# EasyEDA Pro project GD32F470IIH6.epro, board PCB1
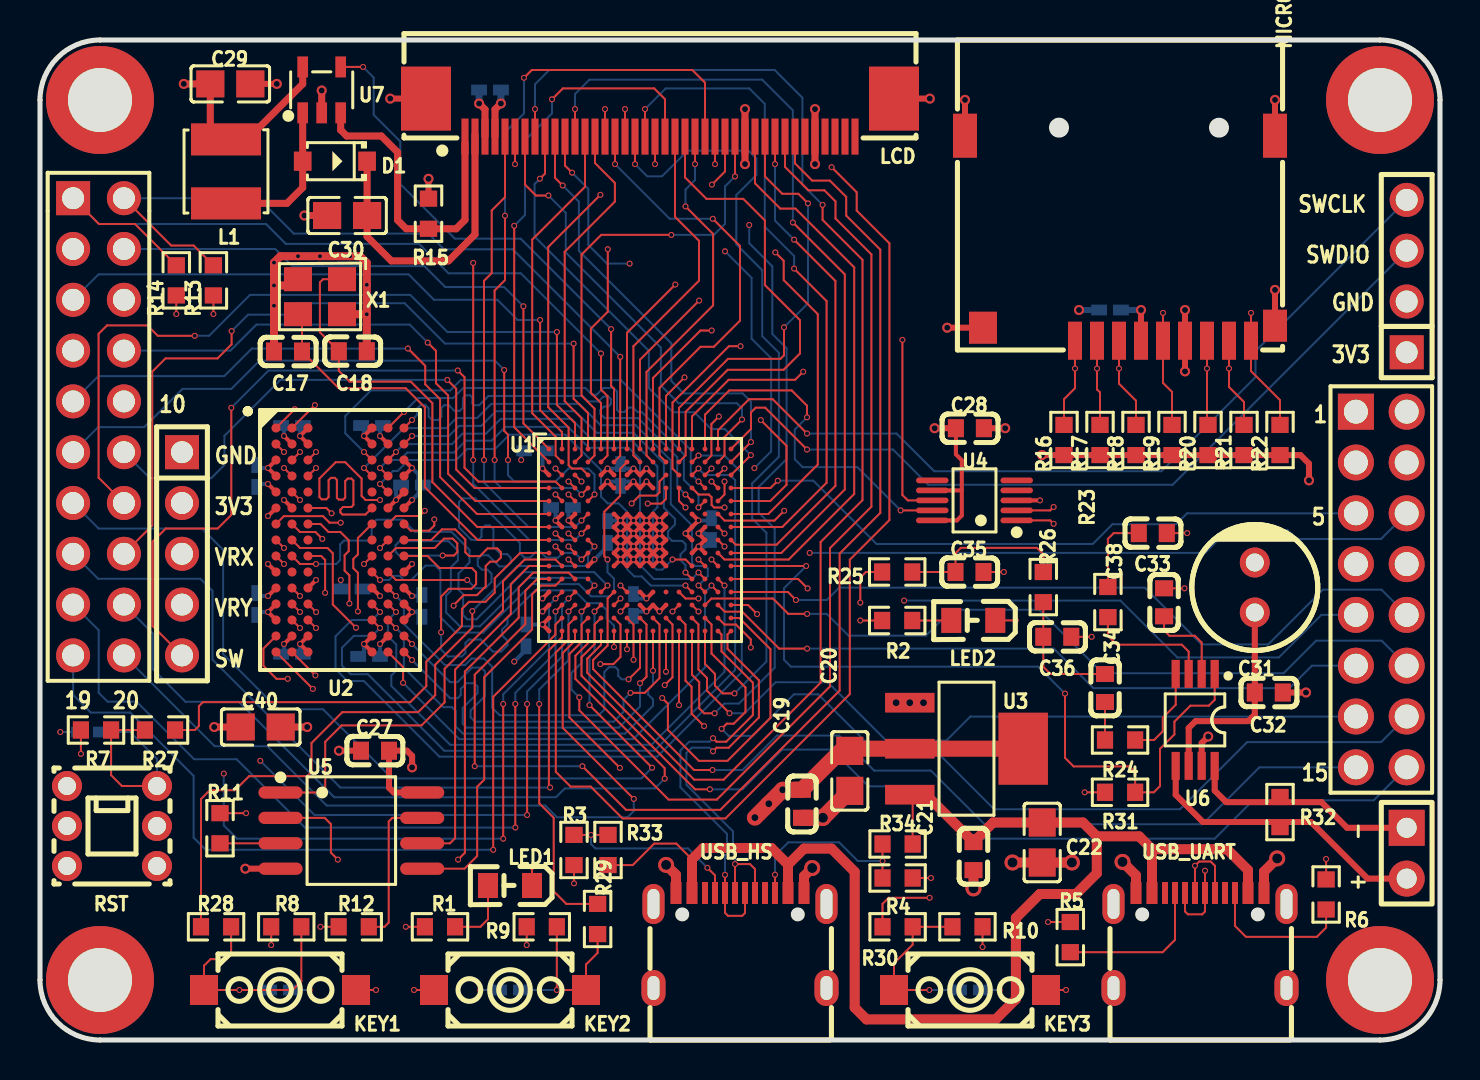
[diagram p1: board, top side]
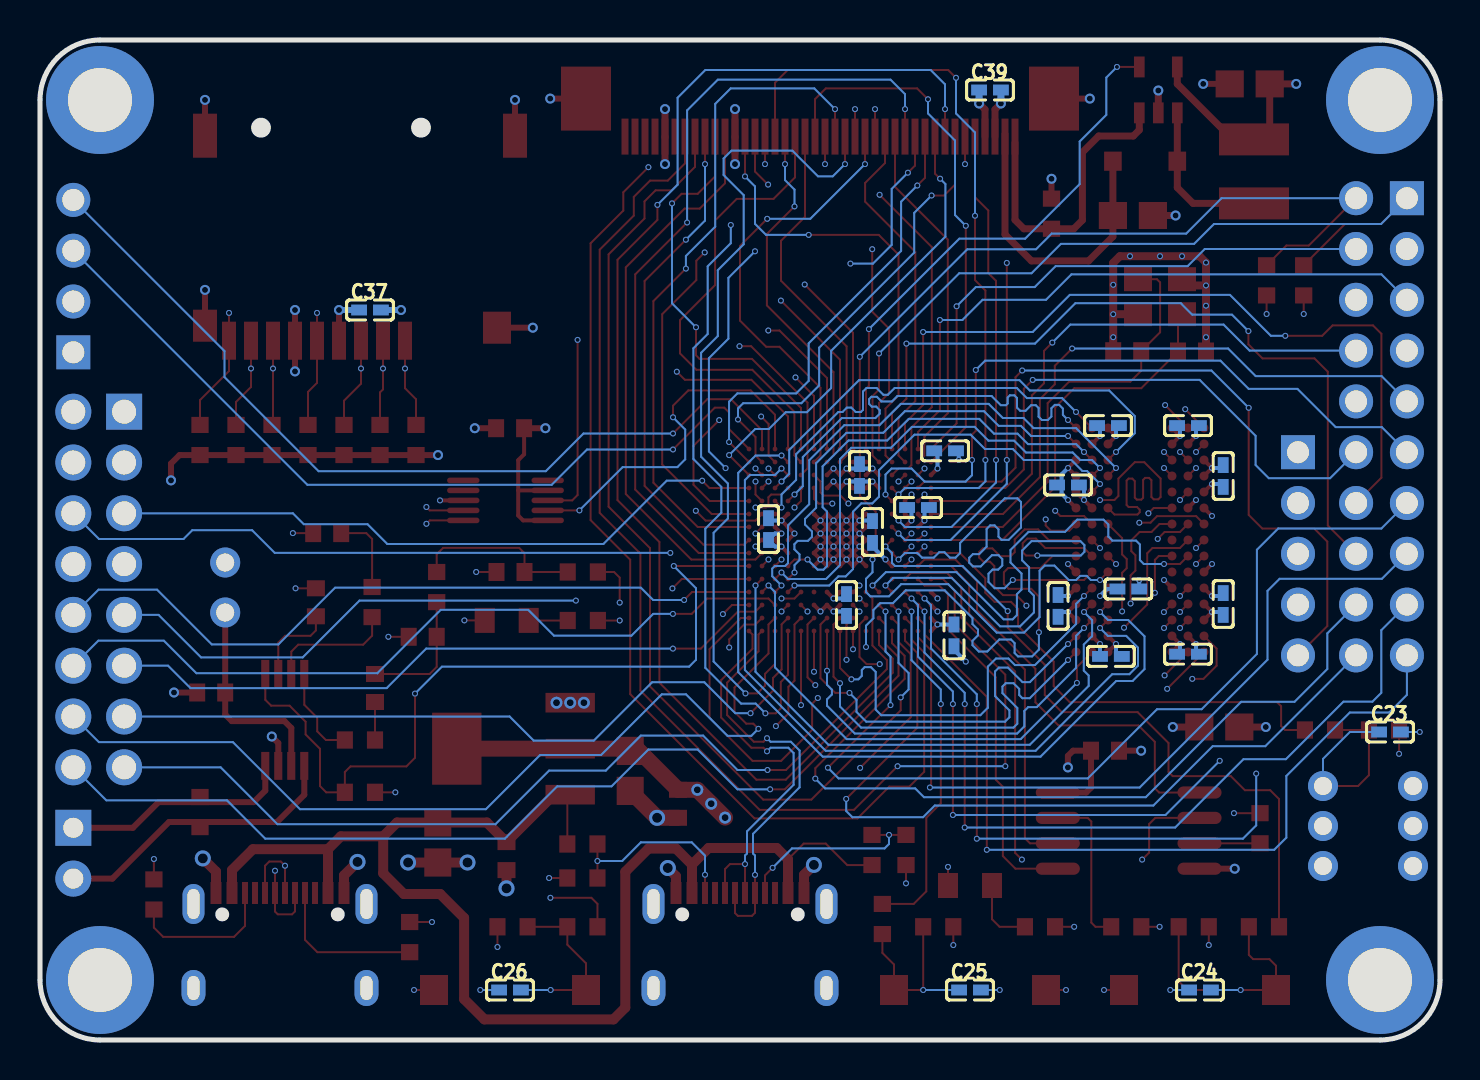
[diagram p2: board, bottom side, seen from below]

Outline 70 x 50 mm; copper layers: Top Layer, GND1, PWR, SIG, GND2, Bottom Layer. Coordinates in mm from the lower left corner of the outline.
Outline path: 0,47 0,3 arc(0.88,0.88) 3,0 67,0 arc(69.12,0.88) 70,3 70,47 arc(69.12,49.12) 67,50 3,50 arc(0.88,49.12) 0,47
Stack: Top Layer 0.035mm 外层铜厚1oz / Dielectric1 0.0994mm 3313 RC57% 4.2mil / GND1 0.0152mm 内层铜厚 / Dielectric2 0.55mm 0.55mm H/H不含铜 / PWR 0.0152mm 内层铜厚 / Dielectric3 0.1088mm 2116 RC54% 4.9mil / SIG 0.0152mm 内层铜厚 / Dielectric4 0.55mm 0.55mm H/H不含铜 / GND2 0.0152mm 内层铜厚 / Dielectric5 0.0994mm 3313 RC57% 4.2mil / Bottom Layer 0.035mm 外层铜厚1oz

## Design rules (mm)
net F_CS: SPI_FLASH
net D+: DP2
net D-: DP2
net LCD_R0: LCD
net LCD_R1: LCD
net F_MISO: SPI_FLASH
net F_MOSI: SPI_FLASH
net F_SCLK: SPI_FLASH
net LCD_DE: LCD
net LCD_VS: LCD
net LCD_HS: LCD
net LCD_EN: LCD
net LCD_CLK: LCD
net LCD_B7: LCD
net LCD_B6: LCD
net LCD_B5: LCD
net LCD_B4: LCD
net LCD_B3: LCD
net LCD_B2: LCD
net LCD_B1: LCD
net LCD_B0: LCD
net LCD_G7: LCD
net LCD_G6: LCD
net LCD_G5: LCD
net LCD_G4: LCD
net LCD_G3: LCD
net LCD_G2: LCD
net LCD_G1: LCD
net LCD_G0: LCD
net LCD_R7: LCD
net LCD_R6: LCD
net LCD_R5: LCD
net LCD_R4: LCD
net LCD_R3: LCD
net LCD_R2: LCD
net USB_DP: DP1
net USB_DN: DP1
template: 用户自定义配置
spacing safeClearance (default): track to track 0.11, other pairs 0.11 to 0.3
track width trackWidth (default): min 0.099, default 0.254, max 2.54
differential pair differentialPair (default): width min 0.1, default 0.1, max 2.54; gap min 0.1, default 0.2
via viaSize (default): diameter min 0.3, default 0.61, max 10; hole min 0.099, default 0.305, max 5.999

## Placement (name value [footprint] x y rotation side)
C1  100nF  [C0402]  24.75 29.46 0 bottom
C2  100nF  [C0402]  29.03 28.25 90 bottom
C3  100nF  [C0402]  26.1 26.62 0 bottom
C4  100nF  [C0402]  33.57 25.55 270 bottom
C5  100nF  [C0402]  28.38 25.4 270 bottom
C6  100nF  [C0402]  29.68 21.75 270 bottom
C7  100nF  [C0402]  24.3 20.23 90 bottom
C8  100nF  [C0402]  12.6 30.72 180 bottom
C9  100nF  [C0402]  16.6 30.72 180 bottom
C10  100nF  [C0402]  18.6 27.75 0 bottom
C11  100nF  [C0402]  10.84 28.2 270 bottom
C12  100nF  [C0402]  10.84 21.8 90 bottom
C13  100nF  [C0402]  15.58 22.55 0 bottom
C14  100nF  [C0402]  19.09 21.7 270 bottom
C15  100nF  [C0402]  12.6 19.29 180 bottom
C16  100nF  [C0402]  16.45 19.18 180 bottom
C17  12pF  [C0603]  12.4 34.42 180 top
C18  12pF  [C0603]  15.64 34.44 0 top
C19  100nF  [C0603]  38.1 11.81 90 top
C20  10uF  [C0805]  40.49 13.45 90 top
C21  100nF  [C0603]  46.68 9.19 90 top
C22  10uF  [C0805]  50.11 9.88 90 top
C23  100nF  [C0402]  2.5 15.4 0 bottom
C24  100nF  [C0402]  12 2.5 180 bottom
C25  100nF  [C0402]  23.5 2.5 0 bottom
C26  100nF  [C0402]  46.5 2.5 180 bottom
C27  100nF  [C0603]  16.75 14.47 0 top
C28  100nF  [C0603]  46.5 30.59 180 top
C29  22uF  [C0805]  9.52 47.81 180 top
C30  10uF  [C0805]  15.36 41.22 0 top
C31  470uF  [CAP-TH_BD6.3-P2.50-D0.5-FD]  60.74 22.62 90 top
C32  100nF  [C0603]  61.44 17.38 180 top
C33  3.3nF  [C0603]  55.64 25.34 180 top
C34  3.3nF  [C0603]  53.25 17.6 270 top
C35  100nF  [C0603]  46.47 23.4 180 top
C36  10nF  [C0603]  50.87 20.16 180 top
C37  100nF  [C0402]  53.5 36.5 0 bottom
C38  NC  [C0603]  56.21 21.89 90 top
C39  100nF  [C0402]  22.5 47.5 0 bottom
C40  10uF  [C0805]  11.03 15.65 0 top
D1  1N5819W S4  [SOD-123_L2.7-W1.6-LS3.7-FD]  14.75 43.94 0 top
H1  -  [HDR-TH_20P-P2.54-V-M-R2-C10-S2.54]  2.92 30.66 270 top
H2  -  [HDR-TH_16P-P2.54-V-M-R2-C8-S2.54]  67.06 22.53 270 top
H3  -  [HDR-TH_4P-P2.54-V-M]  68.34 38.19 90 top
H4  -  [HDR-TH_2P-P2.54-V-M-1]  68.34 9.34 270 top
H5  -  [HDR-TH_5P-P2.54-V-M]  7.1 24.31 270 top
KEY1  K2-1107ST-A4DW-06  [KEY-SMD_L6.2-W3.6-LS8.0]  12 2.5 180 top
KEY2  K2-1107ST-A4DW-06  [KEY-SMD_L6.2-W3.6-LS8.0]  23.5 2.5 0 top
KEY3  K2-1107ST-A4DW-06  [KEY-SMD_L6.2-W3.6-LS8.0]  46.5 2.5 180 top
L1  10uH  [IND-SMD_L4.0-W4.0]  9.3 43.43 270 top
LCD  ZX-0.5FPC-2H-CTSX40P  [FPC-SMD_40P-P0.50_ZX-0.5FPC-2H-CTSX40P]  31 46.12 180 top
LED1  XL-2012UGC  [LED0805-RD_GREEN]  23.5 7.72 180 top
LED2  XL-2012UGC  [LED0805-RD_GREEN]  46.66 20.98 180 top
MICRO-SD  MR01A-01211  [TF-SMD_MR01A-01211]  54 40.09 180 top
NOREF  -  [Pad_e4917]  3 3 0 top
NOREF#2  -  [Pad_e4913]  3 47 0 top
NOREF#3  -  [Pad_e4916]  67 3 0 top
NOREF#4  -  [Pad_e4915]  67 47 0 top
R1  2.2kΩ  [R0603]  20 5.66 180 top
R2  2.2kΩ  [R0603]  42.86 20.97 180 top
R3  5.1kΩ  [R0603]  26.7 9.5 90 top
R4  5.1kΩ  [R0603]  42.88 8.1 180 top
R5  5.1kΩ  [R0603]  51.51 5.14 270 top
R6  5.1kΩ  [R0603]  64.31 7.28 270 top
R7  10kΩ  [R0603]  2.8 15.5 180 top
R8  10kΩ  [R0603]  12.31 5.66 180 top
R9  10kΩ  [R0603]  25.09 5.66 180 top
R10  10kΩ  [R0603]  46.37 5.66 0 top
R11  10kΩ  [R0603]  9 10.59 270 top
R12  10kΩ  [R0603]  15.69 5.66 0 top
R13  2.2kΩ  [R0603]  8.67 37.98 270 top
R14  2.2kΩ  [R0603]  6.81 37.98 270 top
R15  5.1Ω  [R0603]  19.43 41.31 90 top
R16  10kΩ  [R0603]  51.2 30 270 top
R17  10kΩ  [R0603]  53 30 270 top
R18  10kΩ  [R0603]  54.8 30 270 top
R19  NC  [R0603]  56.6 30 270 top
R20  10kΩ  [R0603]  58.4 30 270 top
R21  10kΩ  [R0603]  60.2 30 270 top
R22  10kΩ  [R0603]  62 30 270 top
R23  150kΩ  [R0603]  53.4 21.9 270 top
R24  150kΩ  [R0603]  54 15 0 top
R25  6.2Ω  [R0603]  42.86 23.4 0 top
R26  56Ω  [R0603]  50.16 22.65 270 top
R27  56Ω  [R0603]  6 15.5 180 top
R28  56Ω  [R0603]  8.8 5.66 0 top
R29  56Ω  [R0603]  27.88 6.05 270 top
R30  56Ω  [R0603]  42.88 5.66 0 top
R31  NC  [R0603]  54 12.39 0 top
R32  NC  [R0603]  62 11.4 90 top
R33  NC  [R0603]  28.4 9.5 270 top
R34  NC  [R0603]  42.88 9.8 0 top
RST  PS-5850DVA-6PL  [SW-TH_6P-L5.8-W5.8-P2.00-LS4.5_PS-5850DVA-6PL]  3.6 10.7 270 top
U1  GD32F470IIH6  [BGA-201_L10.0-W10.0-P0.65-TL_GD32F450XXX]  30 25 0 top
U2  IS42S32800G-6BLI  [BGA-90_L13.0-W8.0-R6-C15-P0.80-TL]  15 25 0 top
U3  AMS1117-3.3  [SOT-223-4_L6.5-W3.5-P2.30-LS7.0-BR]  46.32 14.56 180 top
U4  CH340E  [MSOP-10_L3.0-W3.0-P0.50-LS5.0-BL]  46.72 26.98 90 top
U5  GD25Q128ESIGR  [SOP-8_L5.3-W5.3-P1.27-LS8.0-BL]  15.57 10.47 270 top
U6  BL6306MM  [MSOP-8_L3.0-W3.0-P0.65-LS4.9-BL]  57.76 16 180 top
U7  SGM3766YTN5G/TR  [TSOT-23-5_L2.9-W1.6-P0.95-LS2.8-BL]  14.08 47.5 0 top
USB_HS  TYPE-C 16PIN 2MD(073)  [USB-C-SMD_TYPE-C-6PIN-2MD-073]  35 4.97 0 top
USB_UART  TYPE-C 16PIN 2MD(073)  [USB-C-SMD_TYPE-C-6PIN-2MD-073]  58 4.97 0 top
X1  8MHz  [OSC-SMD_4P-L3.2-W2.5-BL]  14 37.17 180 top

## Footprints (pads in the part's own frame, mm; a bottom-side part is the same pattern mirrored in y, then rotated)
BGA-90_L13.0-W8.0-R6-C15-P0.80-TL
  round 0.45 smd: A1(-3.2,5.6) A2(-2.4,5.6) A3(-1.6,5.6) A7(1.6,5.6) A8(2.4,5.6) A9(3.2,5.6) B1(-3.2,4.8) B2(-2.4,4.8) B3(-1.6,4.8) B7(1.6,4.8) B8(2.4,4.8) B9(3.2,4.8) C1(-3.2,4) C2(-2.4,4) C3(-1.6,4) C7(1.6,4) C8(2.4,4) C9(3.2,4) D1(-3.2,3.2) D2(-2.4,3.2) D3(-1.6,3.2) D7(1.6,3.2) D8(2.4,3.2) D9(3.2,3.2) E1(-3.2,2.4) E2(-2.4,2.4) E3(-1.6,2.4) E7(1.6,2.4) E8(2.4,2.4) E9(3.2,2.4) F1(-3.2,1.6) F2(-2.4,1.6) F3(-1.6,1.6) F7(1.6,1.6) F8(2.4,1.6) F9(3.2,1.6) G1(-3.2,0.8) G2(-2.4,0.8) G3(-1.6,0.8) G7(1.6,0.8) G8(2.4,0.8) G9(3.2,0.8) H1(-3.2,0) H2(-2.4,0) H3(-1.6,0) H7(1.6,0) H8(2.4,0) H9(3.2,0) J1(-3.2,-0.8) J2(-2.4,-0.8) J3(-1.6,-0.8) J7(1.6,-0.8) J8(2.4,-0.8) J9(3.2,-0.8) K1(-3.2,-1.6) K2(-2.4,-1.6) K3(-1.6,-1.6) K7(1.6,-1.6) K8(2.4,-1.6) K9(3.2,-1.6) L1(-3.2,-2.4) L2(-2.4,-2.4) L3(-1.6,-2.4) L7(1.6,-2.4) L8(2.4,-2.4) L9(3.2,-2.4) M1(-3.2,-3.2) M2(-2.4,-3.2) M3(-1.6,-3.2) M7(1.6,-3.2) M8(2.4,-3.2) M9(3.2,-3.2) N1(-3.2,-4) N2(-2.4,-4) N3(-1.6,-4) N7(1.6,-4) N8(2.4,-4) N9(3.2,-4) P1(-3.2,-4.8) P2(-2.4,-4.8) P3(-1.6,-4.8) P7(1.6,-4.8) P8(2.4,-4.8) P9(3.2,-4.8) R1(-3.2,-5.6) R2(-2.4,-5.6) R3(-1.6,-5.6) R7(1.6,-5.6) R8(2.4,-5.6) R9(3.2,-5.6)
BGA-201_L10.0-W10.0-P0.65-TL_GD32F450XXX
  round 0.24 smd: A1(-4.55,4.55) A2(-3.9,4.55) A3(-3.25,4.55) A4(-2.6,4.55) A5(-1.95,4.55) A6(-1.3,4.55) A7(-0.65,4.55) A8(0,4.55) A9(0.65,4.55) A10(1.3,4.55) A11(1.95,4.55) A12(2.6,4.55) A13(3.25,4.55) A14(3.9,4.55) A15(4.55,4.55) B1(-4.55,3.9) B2(-3.9,3.9) B3(-3.25,3.9) B4(-2.6,3.9) B5(-1.95,3.9) B6(-1.3,3.9) B7(-0.65,3.9) B8(0,3.9) B9(0.65,3.9) B10(1.3,3.9) B11(1.95,3.9) B12(2.6,3.9) B13(3.25,3.9) B14(3.9,3.9) B15(4.55,3.9) C1(-4.55,3.25) C2(-3.9,3.25) C3(-3.25,3.25) C4(-2.6,3.25) C5(-1.95,3.25) C6(-1.3,3.25) C7(-0.65,3.25) C8(0,3.25) C9(0.65,3.25) C10(1.3,3.25) C11(1.95,3.25) C12(2.6,3.25) C13(3.25,3.25) C14(3.9,3.25) C15(4.55,3.25) D1(-4.55,2.6) D2(-3.9,2.6) D3(-3.25,2.6) D4(-2.6,2.6) D5(-1.95,2.6) D6(-1.3,2.6) D7(-0.65,2.6) D8(0,2.6) D9(0.65,2.6) D10(1.3,2.6) D11(1.95,2.6) D12(2.6,2.6) D13(3.25,2.6) D14(3.9,2.6) D15(4.55,2.6) E1(-4.55,1.95) E2(-3.9,1.95) E3(-3.25,1.95) E4(-2.6,1.95) E12(2.6,1.95) E13(3.25,1.95) E14(3.9,1.95) E15(4.55,1.95) F1(-4.55,1.3) F2(-3.9,1.3) F3(-3.25,1.3) F4(-2.6,1.3) F6(-1.3,1.3) F7(-0.65,1.3) F8(0,1.3) F9(0.65,1.3) F10(1.3,1.3) F12(2.6,1.3) F13(3.25,1.3) F14(3.9,1.3) F15(4.55,1.3) G1(-4.55,0.65) G2(-3.9,0.65) G3(-3.25,0.65) G4(-2.6,0.65) G6(-1.3,0.65) G7(-0.65,0.65) G8(0,0.65) G9(0.65,0.65) G10(1.3,0.65) G12(2.6,0.65) G13(3.25,0.65) G14(3.9,0.65) G15(4.55,0.65) H1(-4.55,0) H2(-3.9,0) H3(-3.25,0) H4(-2.6,0) H6(-1.3,0) H7(-0.65,0) H8(0,0) H9(0.65,0) H10(1.3,0) H12(2.6,0) H13(3.25,0) H14(3.9,0) H15(4.55,0) J1(-4.55,-0.65) J2(-3.9,-0.65) J3(-3.25,-0.65) J4(-2.6,-0.65) J6(-1.3,-0.65) J7(-0.65,-0.65) J8(0,-0.65) J9(0.65,-0.65) J10(1.3,-0.65) J12(2.6,-0.65) J13(3.25,-0.65) J14(3.9,-0.65) J15(4.55,-0.65) K1(-4.55,-1.3) K2(-3.9,-1.3) K3(-3.25,-1.3) K4(-2.6,-1.3) K6(-1.3,-1.3) K7(-0.65,-1.3) K8(0,-1.3) K9(0.65,-1.3) K10(1.3,-1.3) K12(2.6,-1.3) K13(3.25,-1.3) K14(3.9,-1.3) K15(4.55,-1.3) L1(-4.55,-1.95) L2(-3.9,-1.95) L3(-3.25,-1.95) L4(-2.6,-1.95) L12(2.6,-1.95) L13(3.25,-1.95) L14(3.9,-1.95) L15(4.55,-1.95) M1(-4.55,-2.6) M2(-3.9,-2.6) M3(-3.25,-2.6) M4(-2.6,-2.6) M5(-1.95,-2.6) M6(-1.3,-2.6) M7(-0.65,-2.6) M8(0,-2.6) M9(0.65,-2.6) M10(1.3,-2.6) M11(1.95,-2.6) M12(2.6,-2.6) M13(3.25,-2.6) M14(3.9,-2.6) M15(4.55,-2.6) N1(-4.55,-3.25) N2(-3.9,-3.25) N3(-3.25,-3.25) N4(-2.6,-3.25) N5(-1.95,-3.25) N6(-1.3,-3.25) N7(-0.65,-3.25) N8(0,-3.25) N9(0.65,-3.25) N10(1.3,-3.25) N11(1.95,-3.25) N12(2.6,-3.25) N13(3.25,-3.25) N14(3.9,-3.25) N15(4.55,-3.25) P1(-4.55,-3.9) P2(-3.9,-3.9) P3(-3.25,-3.9) P4(-2.6,-3.9) P5(-1.95,-3.9) P6(-1.3,-3.9) P7(-0.65,-3.9) P8(0,-3.9) P9(0.65,-3.9) P10(1.3,-3.9) P11(1.95,-3.9) P12(2.6,-3.9) P13(3.25,-3.9) P14(3.9,-3.9) P15(4.55,-3.9) R1(-4.55,-4.55) R2(-3.9,-4.55) R3(-3.25,-4.55) R4(-2.6,-4.55) R5(-1.95,-4.55) R6(-1.3,-4.55) R7(-0.65,-4.55) R8(0,-4.55) R9(0.65,-4.55) R10(1.3,-4.55) R11(1.95,-4.55) R12(2.6,-4.55) R13(3.25,-4.55) R14(3.9,-4.55) R15(4.55,-4.55)
C0402
  rect 0.79x0.54 smd: 1(-0.545,0) 2(0.545,0)
C0603
  rect 0.8x0.9 smd: 1(-0.7,0) 2(0.7,0)
C0805
  rect 1.41x1.35 smd: 1(-1,0) 2(1,0)
CAP-TH_BD6.3-P2.50-D0.5-FD
  round 1.5 hole 0.9: 1(-1.25,0) 2(1.25,0)
FPC-SMD_40P-P0.50_ZX-0.5FPC-2H-CTSX40P
  rect 0.35x1.8 smd: 1(9.75,0.95) 2(9.25,0.95) 3(8.75,0.95) 4(8.25,0.95) 5(7.75,0.95) 6(7.25,0.95) 7(6.75,0.95) 8(6.25,0.95) 9(5.75,0.95) 10(5.25,0.95) 11(4.75,0.95) 12(4.25,0.95) 13(3.75,0.95) 14(3.25,0.95) 15(2.75,0.95) 16(2.25,0.95) 17(1.75,0.95) 18(1.25,0.95) 19(0.75,0.95) 20(0.25,0.95) 21(-0.25,0.95) 22(-0.75,0.95) 23(-1.25,0.95) 24(-1.75,0.95) 25(-2.25,0.95) 26(-2.75,0.95) 27(-3.25,0.95) 28(-3.75,0.95) 29(-4.25,0.95) 30(-4.75,0.95) 31(-5.25,0.95) 32(-5.75,0.95) 33(-6.25,0.95) 34(-6.75,0.95) 35(-7.25,0.95) 36(-7.75,0.95) 37(-8.25,0.95) 38(-8.75,0.95) 39(-9.25,0.95) 40(-9.75,0.95)
  rect 2.5x3.2 smd: 41(-11.7,-0.95) 42(11.7,-0.95)
HDR-TH_2P-P2.54-V-M-1
  rect 1.8x1.8 hole 1: 1(-1.27,0)
  round 1.8 hole 1: 2(1.27,0)
HDR-TH_4P-P2.54-V-M
  rect 1.7x1.7 hole 1.1: 1(-3.81,0)
  round 1.7 hole 1.1: 2(-1.27,0) 3(1.27,0) 4(3.81,0)
HDR-TH_5P-P2.54-V-M
  rect 1.7x1.7 hole 1.1: 1(-5.08,0)
  round 1.7 hole 1.1: 2(-2.54,0) 3(0,0) 4(2.54,0) 5(5.08,0)
HDR-TH_16P-P2.54-V-M-R2-C8-S2.54
  rect 1.8x1.8 hole 1.2: 1(-8.89,-1.27)
  round 1.8 hole 1.2: 2(-8.89,1.27) 3(-6.35,-1.27) 4(-6.35,1.27) 5(-3.81,-1.27) 6(-3.81,1.27) 7(-1.27,-1.27) 8(-1.27,1.27) 9(1.27,-1.27) 10(1.27,1.27) 11(3.81,-1.27) 12(3.81,1.27) 13(6.35,-1.27) 14(6.35,1.27) 15(8.89,-1.27) 16(8.89,1.27)
HDR-TH_20P-P2.54-V-M-R2-C10-S2.54
  rect 1.7x1.7 hole 1.1: 1(-11.43,-1.27)
  round 1.7 hole 1.1: 2(-11.43,1.27) 3(-8.89,-1.27) 4(-8.89,1.27) 5(-6.35,-1.27) 6(-6.35,1.27) 7(-3.81,-1.27) 8(-3.81,1.27) 9(-1.27,-1.27) 10(-1.27,1.27) 11(1.27,-1.27) 12(1.27,1.27) 13(3.81,-1.27) 14(3.81,1.27) 15(6.35,-1.27) 16(6.35,1.27) 17(8.89,-1.27) 18(8.89,1.27) 19(11.43,-1.27) 20(11.43,1.27)
IND-SMD_L4.0-W4.0
  rect 1.6x3.5 smd: 1(-1.6,0) 2(1.6,0)
KEY-SMD_L6.2-W3.6-LS8.0
  rect 1.4x1.5 smd: 1(-3.8,0) 2(3.8,0)
LED0805-RD_GREEN
  rect 1x1.25 smd: 1(-1.1,0) 2(1.1,0)
MSOP-8_L3.0-W3.0-P0.65-LS4.9-BL
  rect 0.406x1.397 smd: 1(-0.975,-2.3) 2(-0.325,-2.3) 3(0.325,-2.3) 4(0.975,-2.3) 5(0.975,2.3) 6(0.325,2.3) 7(-0.325,2.3) 8(-0.975,2.3)
MSOP-10_L3.0-W3.0-P0.50-LS5.0-BL
  oval 0.28x1.62 smd: 1(-1,-2.11) 2(-0.5,-2.11) 3(0,-2.11) 4(0.5,-2.11) 5(1,-2.11) 6(1,2.11) 7(0.5,2.11) 8(0,2.11) 9(-0.5,2.11) 10(-1,2.11)
OSC-SMD_4P-L3.2-W2.5-BL
  rect 1.4x1.2 smd: 1(-1.1,-0.875) 2(1.1,-0.875) 3(1.1,0.875) 4(-1.1,0.875)
Pad_e4913
  round 5.4 hole 3.2: 1(0,0)
Pad_e4915
  round 5.4 hole 3.2: 1(0,0)
Pad_e4916
  round 5.4 hole 3.2: 1(0,0)
Pad_e4917
  round 5.4 hole 3.2: 1(0,0)
R0603
  rect 0.806x0.864 smd: 1(-0.753,0) 2(0.753,0)
SOD-123_L2.7-W1.6-LS3.7-FD
  rect 0.88x0.96 smd: 1(-1.61,0) 2(1.61,0)
SOP-8_L5.3-W5.3-P1.27-LS8.0-BL
  oval 0.609x2.204 smd: 1(-1.905,-3.542) 2(-0.635,-3.542) 3(0.635,-3.542) 4(1.905,-3.542) 5(1.905,3.542) 6(0.635,3.542) 7(-0.635,3.542) 8(-1.905,3.542)
SOT-223-4_L6.5-W3.5-P2.30-LS7.0-BR
  rect 2.47x0.98 smd: 1(2.835,-2.3) 2(2.835,0) 3(2.835,2.3)
  rect 2.47x3.6 smd: 4(-2.835,0)
SW-TH_6P-L5.8-W5.8-P2.00-LS4.5_PS-5850DVA-6PL
  round 1.5 hole 0.9: 1(-2,-2.25) 2(0,-2.25) 3(2,-2.25) 4(-2,2.25) 5(0,2.25) 6(2,2.25)
TF-SMD_MR01A-01211
  rect 0.7x1.9 smd: 1(2.25,5.125) 2(1.15,5.125) 3(0.05,5.125) 4(-1.05,5.125) 5(-2.15,5.125) 6(-3.25,5.125) 7(-4.35,5.125) 8(-5.45,5.125) 9(-6.55,5.125)
  rect 1.2x1.6 smd: 10(-7.75,4.375)
  rect 1.2x2.2 smd: 11(-7.75,-5.125) 12(7.75,-5.125)
  rect 1.4x1.6 smd: 13(6.85,4.475)
TSOT-23-5_L2.9-W1.6-P0.95-LS2.8-BL
  rect 0.532x1.045 smd: 1(-0.95,-1.147) 2(0,-1.147) 3(0.95,-1.147) 4(0.95,1.147) 5(-0.95,1.147)
USB-C-SMD_TYPE-C-6PIN-2MD-073
  rect 0.55x1.1 smd: 1(-3.2,2.375) 2(-2.4,2.375) 11(2.4,2.375) 12(3.2,2.375)
  rect 0.3x1.1 smd: 3(-1.75,2.375) 4(-1.25,2.375) 5(-0.75,2.375) 6(-0.25,2.375) 7(0.25,2.375) 8(0.75,2.375) 9(1.25,2.375) 10(1.75,2.375)
  oval 1.1x2 hole 0.6x1.5: 13(-4.325,1.825) 14(4.325,1.825)
  oval 1.2x1.8 hole 0.6x1.2: 13(-4.325,-2.375) 14(4.325,-2.375)

## Nets
As in the schematic, except:
GND: C1.1 C2.1 C3.1 C4.1 C5.1 C6.1 C7.1 C8.1 C9.1 C10.1 C11.1 C12.1 C13.1 C14.1 C15.1 C16.1 C17.2 C18.2 C19.1 C20.1 C21.1 C22.1 C23.1 C24.1 C25.1 C26.1 C27.1 C28.1 C29.1 C30.1 C31.2 C32.1 C33.1 C35.1 C36.1 C37.1 C38.2 C39.1 C40.1 H1.3 H1.7 H2.7 H3.2 H5.1 KEY1.1 KEY2.1 KEY3.1 LCD.3 LCD.29 LCD.36 LCD.41 LCD.42 LED1.1 LED2.1 MICRO-SD.6 MICRO-SD.10 MICRO-SD.11 MICRO-SD.12 MICRO-SD.13 NOREF.1 NOREF#2.1 NOREF#3.1 NOREF#4.1 R3.1 R4.1 R5.1 R6.1 R15.2 RST.5 U1.D5 U1.D6 U1.D7 U1.D8 U1.D9 U1.F2 U1.F6 U1.F7 U1.F8 U1.F9 U1.F10 U1.F12 U1.G2 U1.G6 U1.G7 U1.G8 U1.G9 U1.G10 U1.G12 U1.H6 U1.H7 U1.H8 U1.H9 U1.H10 U1.H12 U1.J6 U1.J7 U1.J8 U1.J9 U1.J10 U1.K6 U1.K7 U1.K8 U1.K9 U1.K10 U1.M1 U1.M8 U1.M9 U1.N1 U2.A3 U2.B3 U2.B8 U2.C1 U2.D1 U2.E9 U2.F1 U2.F2 U2.F8 U2.K1 U2.K9 U2.L3 U2.L9 U2.M1 U2.N1 U2.P3 U2.P8 U2.R3 U3.1 U4.3 U5.4 U6.7 U7.2 USB_HS.1 USB_HS.12 USB_HS.13 USB_HS.14 USB_UART.1 USB_UART.12 USB_UART.13 USB_UART.14 X1.2 X1.4

Pads without a net: LCD 35 37 38 39 40; RST 1 2 3 6; U1 F13 L4 M10; U2 E3 E7 H3 H7 K2 K3; U4 4 5 6; USB_HS 3 9; USB_UART 3 9

## Via types
v1: diameter 0.3, hole 0.2, Top Layer to Bottom Layer, 361 vias
v2: diameter 0.8, hole 0.5, Top Layer to Bottom Layer, 8 vias
v3: diameter 0.5, hole 0.3, Top Layer to Bottom Layer, 32 vias
v4: diameter 0.6, hole 0.35, Top Layer to Bottom Layer, 6 vias

## Routing (per net, layer and track width the routed paths; a pad name or vN(x,y) marks a point on that pad's centre or on a via; arc(x,y) is an arc through that point)
3V3: length 112.8
  Top Layer w0.1: v1(6.81,36.3) R14.2 ; 47.13,5.66 v1(47.13,4.65) ; v1(10.3,11.34) R11.1 ; R8.2 v1(11.56,4.75) ; v1(8.67,36.3) R13.2 ; R31.1 v1(52.23,12.39) ; R7.2 v1(2.05,14.31) ; 14.93,5.66 v1(14.02,5.66) ; 19.21,5.66 v1(18.29,5.66) ; R9.2 v1(24.34,4.75)
  Top Layer w0.2: U2.A7 v1(16.2,30.2) U2.B7 ; v1(11.4,27.8) U2.E1 ; U1.R1 v1(25.12,20.78) U1.P1 ; U1.G3 v1(26.43,25.97) U1.F3 ; U1.K4 v1(27.72,24.03) ; U1.C6 v1(28.38,28.58) U1.C5 ; v1(32.93,24.67) U1.J13 ; v1(32.93,24.67) U1.J12 ; v1(32.93,24.67) U1.H13 v1(32.93,25.33) U1.G13 ; U2.L1 v1(11.4,22.2) ; 44.62,27.48 46.09,27.48 ; 46.09,27.48 46.09,28.99 45.79,29.28 C28.2 ; 46.09,27.48 46.09,26.22 45.84,25.98 44.62,25.98 ; U1.C7 v1(29.68,28.58) U1.C8 v1(30.32,28.58) U1.C9 ; U2.N9 v1(18.6,21.4) U2.M9 ; U2.R7 v1(16.2,19.8) U2.P7 ; v1(12.2,30.2) U2.B2 ; U2.F9 v1(18.6,27) ; U2.C9 v1(18.6,28.6) U2.D9 ; U1.C1 v1(25.12,28.58) ; U2.P2 v1(12.2,19.8) ; U1.N10 v1(30.97,21.42) U1.N9 v1(30.32,21.42) U1.N8 ; U2.L7 v1(17,22.2)
  Top Layer w0.3: v3(63.45,27.98) 63.45,28.82 63.02,29.25 R22.2 R21.2 R20.2 R19.2 R18.2 R17.2 R16.2 v3(50.1,29.25) ; 57.43,13.7 57.43,15.6 57.78,15.94 60.41,15.94 60.74,16.28 C32.2 C31.1 ; U5.8 17.69,12.38 17.45,12.61 C27.2 18.34,14.47 18.6,14.2 v3(18.6,13.63) ; MICRO-SD.4 v3(55.05,36.5) ; v3(44.73,30.59) C28.2
  Top Layer w0.35: v3(23.04,46.83) 22.75,46.53 LCD.4 ; v3(7.19,47.81) C29.2 8.52,45.46 9.05,44.93 10.27,44.93 13.14,47.8 13.14,48.65 ; C40.2 v3(13.36,15.65)
  Top Layer w0.8: U3.4 U3.2 40.16,14.56 C19.2 v4(37.13,12.51) v4(36.44,11.81) v4(35.75,11.12)
  Bottom Layer w0.2: C6.2 29.9,21.42 v1(30.32,21.42) ; v1(32.93,24.67) 33.25,24.67 C4.2 33.25,25.33 v1(32.93,25.33) ; v1(28.38,28.58) v1(29.68,28.58) ; v1(26.43,25.97) 26.43,26.41 C3.2 ; C14.2 18.85,21.4 v1(18.6,21.4) ; v1(27.72,24.03) 28.38,24.67 C5.2 ; v1(17,22.2) 16.65,22.55 C13.2 ; C11.2 10.98,27.8 v1(11.4,27.8) ; v1(11.4,22.2) 10.98,22.2 C12.2 ; v1(16.2,19.8) 16.2,19.38 16,19.18 C16.2 ; v1(25.12,28.58) 25.12,29.3 C1.2 ; 12.06,30.72 12.2,30.58 v1(12.2,30.2) ; v1(18.6,27) 18.92,27.32 18.92,28.28 v1(18.6,28.6) ; v1(16.2,30.2) 16.2,30.58 16.06,30.72 ; C7.2 v1(25.12,20.78) ; v1(12.2,19.8) 12.2,19.44 12.06,19.29
  Bottom Layer w0.3: C37.2 v3(55.05,36.5)
  Bottom Layer w0.35: v3(23.04,46.83) C39.2
5V: length 69.1
  Top Layer w0.1: R34.2 43.63,12.12 U3.3 ; R33.2 29.64,8.75 30.71,9.82 31.81,9.82 32.6,9.03
  Top Layer w0.5: U3.3 44.31,12.27 C21.2 47.66,10.88 C22.2 52.15,10.88 52.84,10.18 ; USB_UART.11 60.4,8.49 59.35,9.54 55.6,9.54 ; 37.4,8.77 36.57,9.6 33.16,9.6 32.6,9.03 USB_HS.2 ; 37.4,8.77 38.2,9.57 39.57,9.57 40.74,8.41 40.74,1.62 41.32,1.03 47.78,1.03 48.79,2.05 48.79,6.11 49.99,7.3 51.81,7.3 52.84,8.33 52.84,10.18 ; 37.4,8.77 USB_HS.11 ; 55.6,9.54 54.96,10.18 52.84,10.18 ; 55.6,9.54 USB_UART.2
GND: length 141
  Top Layer w0.1: C36.1 v1(52.58,20.16) ; R6.1 v1(64.31,9.05) ; v1(24.6,8.66) LED1.1 ; KEY2.1 v1(18.7,2.5) ; R5.1 v1(50.4,5.9) ; R4.1 v1(44.55,8.1) ; C33.1 v1(57.36,25.34) ; KEY3.1 v1(51.3,2.5) ; R3.1 v1(26.7,7.83) ; 56.21,22.58 v1(57.22,22.58) ; LED2.1 v1(48.78,20.98) ; 47.18,23.4 v1(48.19,23.4) ; KEY1.1 v1(16.8,2.5)
  Top Layer w0.2: v1(29.68,25.33) U1.G7 ; v1(29.68,25.33) U1.H7 ; v1(29.68,25.33) U1.G8 ; v1(29.68,25.33) U1.H8 ; U1.G7 v1(29.68,25.97) ; U1.G7 v1(29.03,25.33) ; U1.G7 v1(29.03,25.97) ; v1(29.68,25.97) U1.G8 ; v1(29.68,25.97) U1.F8 v1(30.32,25.97) ; v1(29.68,25.97) U1.F7 v1(29.03,25.97) ; v1(29.03,24.67) U1.J6 v1(29.03,24.03) ; v1(29.03,24.67) U1.J7 ; v1(29.03,24.67) U1.H7 ; v1(29.03,24.67) U1.H6 v1(29.03,25.33) ; U1.F2 v1(25.78,25.97) U1.G2 ; v1(30.97,24.67) U1.J9 ; v1(30.97,24.67) U1.J10 v1(30.97,24.03) ; v1(30.97,24.67) U1.H9 ; v1(30.97,24.67) U1.H10 v1(30.97,25.33) ; U1.J9 v1(30.32,24.03) ; U1.J9 v1(30.97,24.03) ; U1.J9 v1(30.32,24.67) ; U1.M8 v1(30.32,22.08) U1.M9 ; v1(29.03,25.97) U1.G6 v1(29.03,25.33) ; v1(29.03,25.97) U1.F6 ; U1.H7 v1(29.03,25.33) ; U1.H7 v1(29.68,24.67) ; U2.A3 v1(13,30.2) U2.B3 ; v1(30.97,25.97) U1.G10 v1(30.97,25.33) ; v1(30.97,25.97) U1.F10 ; v1(30.97,25.97) U1.G9 ; v1(30.97,25.97) U1.F9 v1(30.32,25.97) ; v1(29.03,24.03) U1.K7 v1(29.68,24.03) ; v1(29.03,24.03) U1.J7 ; v1(29.03,24.03) U1.K6 ; U1.D9 v1(30.32,27.92) U1.D8 v1(29.68,27.92) U1.D7 ; U2.L9 v1(18.6,22.2) ; v1(30.32,24.67) U1.J8 ; v1(30.32,24.67) U1.H9 ; v1(30.32,24.67) U1.H8 ; U1.J8 v1(29.68,24.03) ; U1.J8 v1(30.32,24.03) ; U1.J8 v1(29.68,24.67) ; U2.E9 v1(17.8,27) U2.F8 ; U2.P8 v1(17,19.8) ; v1(30.97,25.33) U1.H9 ; v1(30.97,25.33) U1.G9 ; U1.H9 v1(30.32,25.33) ; U1.F12 v1(32.93,25.97) U1.G12 v1(32.28,25.33) U1.H12 ; U1.D5 v1(28.38,27.92) U1.D6 ; v1(30.32,25.97) U1.G8 ; v1(30.32,25.97) U1.G9 ; U1.G8 v1(30.32,25.33) ; U2.C1 v1(11.4,28.6) U2.D1 ; U1.J7 v1(29.68,24.03) ; U1.J7 v1(29.68,24.67) ; v1(29.68,24.03) U1.K8 v1(30.32,24.03) ; v1(25.12,21.42) U1.N1 ; v1(13.8,23) U2.L3 ; U1.G9 v1(30.32,25.33) ; v1(30.32,24.03) U1.K9 v1(30.97,24.03) ; v1(30.97,24.03) U1.K10 ; v1(29.68,24.67) U1.H8 ; v1(17,30.2) U2.B8 ; U1.H8 v1(30.32,25.33) ; U2.R3 v1(13,19.8) U2.P3 ; U2.F2 v1(12.2,27) ; U2.K9 v1(18.6,23.8) ; U4.3 v1(50,26.98) ; U2.M1 v1(11.4,21.4) U2.N1 ; v1(25.12,22.08) U1.M1 ; U2.K1 v1(11.4,23.8) ; v1(11.4,26.2) U2.F1
  Top Layer w0.3: U6.7 58.09,14.85 v3(58.41,15.17) ; U5.4 v3(10.27,8.56) ; MICRO-SD.11 v3(61.75,47.01) ; v3(57.25,33.43) MICRO-SD.6 v3(57.25,36.5) ; C29.1 v3(11.84,47.81) ; LCD.42 v3(17.51,47.07) ; R15.2 v3(19.43,43.06) ; v3(63.3,17.38) C32.1 ; LCD.41 v3(44.49,47.07) ; MICRO-SD.12 v3(46.25,47.01) ; v3(14.94,14.47) C27.1 ; MICRO-SD.10 v3(61.75,37.5) ; MICRO-SD.13 v3(45.36,35.61) ; v3(48.26,30.59) C28.1
  Top Layer w0.35: v3(38.75,46.54) LCD.36 v3(38.75,43.8) ; v3(35.25,46.54) LCD.29 v3(35.25,43.8) ; C30.1 v3(13.22,41.22) ; C40.1 v3(8.71,15.65) ; U7.2 v3(14.08,47.47) ; v3(21.96,46.83) 22.25,46.53 LCD.3
  Top Layer w0.4: X1.2 12.59,37.73 v1(11.7,37.73) ; C18.2 v1(16.34,35.14) v1(16.34,36.29) ; v1(11.7,37.73) v1(11.7,38.87) 12.02,39.19 v1(12.9,39.19) v1(14,39.19) v1(15.5,39.19) 16,39.19 16.34,38.86 v1(16.34,37.76) v1(16.34,36.29) ; v1(11.7,37.73) v1(11.7,36.72) v1(11.7,35.14) C17.2 ; v1(16.34,36.29) X1.4
  Top Layer w0.5: USB_HS.1 31.8,8.26 v2(31.31,8.75) ; 46.68,8.5 v2(46.68,7.58) ; v2(51.59,8.88) C22.1 v2(48.62,8.88) ; USB_UART.12 61.2,8.42 v2(61.86,9.08) ; USB_UART.1 54.8,8.23 v2(54.12,8.91) ; USB_HS.12 38.2,8.19 v2(38.61,8.6)
  Top Layer w0.8: C20.1 v2(39.15,11.11) C19.1
  Bottom Layer w0.1: C25.1 v1(22.01,2.5) ; C23.1 v1(1.02,15.4) ; C24.1 v1(13.48,2.5) ; C26.1 v1(47.99,2.5)
  Bottom Layer w0.2: v1(13,19.8) 13,19.44 C15.1 ; v1(29.03,25.97) 28.41,25.97 28.38,25.94 ; C3.1 25.78,26.41 v1(25.78,25.97) ; v1(32.93,25.97) 33.46,25.97 C4.1 ; 24.28,19.48 v1(23.71,18.92) ; C14.1 19.04,22.2 v1(18.6,22.2) ; 15.04,22.95 15.04,22.49 ; C9.1 17,30.58 v1(17,30.2) ; C6.1 29.9,22.08 v1(30.32,22.08) ; C8.1 13,30.58 v1(13,30.2) ; v1(24.06,29) 24.06,29.32 C1.1 ; C11.1 10.99,28.6 v1(11.4,28.6) ; 17.8,27.77 v1(17.8,27) ; C12.1 10.98,21.4 v1(11.4,21.4) ; v1(17,19.8) C16.1 ; v1(28.38,27.92) v1(29.68,27.92)
  Bottom Layer w0.3: C37.1 v3(51.95,36.5)
  Bottom Layer w0.35: v3(21.96,46.83) C39.1
  vias: v1(15.04,23) v4(42.81,16.86) v4(43.49,16.86) v4(44.18,16.86)
A0: length 24
  Top Layer w0.1: v1(19.24,26.46) 18.98,26.2 17.8,26.2 U2.G8 ; U1.E2 v1(25.78,27.28)
  SIG w0.1: v1(25.78,27.28) 25.44,27.61 25.44,27.83 25.28,28 25.09,28 24.98,27.88 24.98,27.49 24.89,27.4 24.73,27.4 24.63,27.5 24.63,28.45 24.53,28.56 24.23,28.56 24.13,28.45 24.13,27.5 24.03,27.39 23.73,27.39 23.63,27.5 23.63,28.44 23.5,28.56 23.26,28.56 23.13,28.43 23.13,27.5 23.03,27.39 22.73,27.39 22.63,27.5 22.63,28.44 22.51,28.56 22.27,28.56 22.13,28.41 22.13,27.5 22.03,27.39 21.73,27.39 21.63,27.5 21.63,28.44 21.51,28.56 21.26,28.56 21.13,28.42 21.13,27.5 21.03,27.39 20.73,27.39 20.63,27.5 20.63,28.7 20.51,28.81 20.32,28.81 20.19,28.68 20.19,27.52 20.08,27.41 19.84,27.41 19.72,27.53 19.72,28.52 19.61,28.62 19.35,28.62 19.24,28.52 v1(19.24,26.46)
A1: length 24
  Top Layer w0.1: U2.G9 18.53,25.47 19.46,25.47 19.71,25.72 19.71,26.03 ; U1.H3 v1(26.43,25.33)
  SIG w0.1: v1(26.43,25.33) 26.1,25.65 25.44,25.65 25.35,25.75 25.35,26.94 25.25,27.05 24.95,27.05 24.85,26.94 24.85,25.75 24.75,25.65 24.45,25.65 24.35,25.75 24.35,26.94 24.25,27.05 23.95,27.05 23.85,26.94 23.85,25.75 23.75,25.65 23.45,25.65 23.35,25.75 23.35,26.94 23.25,27.05 22.95,27.05 22.85,26.94 22.85,25.75 22.75,25.65 22.45,25.65 22.35,25.75 22.35,26.94 22.25,27.05 21.95,27.05 21.85,26.94 21.85,25.75 21.75,25.65 21.45,25.65 21.35,25.75 21.35,26.94 21.25,27.05 20.95,27.05 20.85,26.94 20.85,25.75 20.75,25.65 20.37,25.65 20.25,25.77 20.25,26.74 20.1,26.89 19.88,26.89 19.72,26.72 v1(19.72,26.03)
A2: length 24
  Top Layer w0.1: v1(17,27) 16.28,27 16.08,27.2 16.08,28.07 15.26,28.89 14.78,28.89 13.97,28.08 13.97,27.15 14.08,27.03 14.31,27.03 14.43,27.15 14.43,27.99 14.55,28.11 14.75,28.11 14.84,28 14.84,27.11 14.94,27.02 15.16,27.02 15.26,27.12 15.26,27.94 15.39,28.07 15.57,28.07 15.67,27.97 15.67,26.75 15.57,26.65 15.15,26.65 15.02,26.52 15.02,26.39 15.12,26.28 16.28,26.28 U2.F7 ; U1.H2 v1(25.78,25.33)
  SIG w0.1: v1(25.78,25.33) 19.54,25.33 18.66,26.2 17.8,26.2 v1(17,27)
A3: length 24
  Top Layer w0.1: v1(14.58,26.33) 14.31,26.6 U2.F3 ; U1.J2 v1(25.78,24.67)
  SIG w0.1: v1(14.58,26.33) 14.23,25.99 13.94,25.99 13.82,25.86 13.82,25.58 13.94,25.45 14.96,25.45 15.17,25.25 15.17,24.66 15.28,24.54 15.67,24.54 15.76,24.63 15.76,25.31 15.88,25.44 16.14,25.44 16.25,25.33 16.25,24.94 16.36,24.84 16.62,24.84 16.76,24.98 16.76,25.32 16.94,25.5 17.27,25.5 17.45,25.31 17.45,24.67 17.64,24.47 17.92,24.47 18.05,24.61 18.05,25.29 18.2,25.44 18.42,25.44 18.56,25.3 18.56,24.57 18.69,24.44 19.12,24.44 19.36,24.67 20.41,24.67 20.57,24.51 20.57,24.14 20.67,24.04 20.95,24.04 21.06,24.16 21.06,24.55 21.16,24.64 21.44,24.64 21.53,24.56 21.53,24.14 21.62,24.05 21.93,24.05 22.03,24.14 22.03,24.56 22.12,24.66 22.43,24.66 22.53,24.56 22.53,24.14 22.62,24.04 22.93,24.04 23.03,24.14 23.03,24.56 23.12,24.66 23.41,24.66 23.53,24.55 23.53,24.12 23.62,24.02 23.88,24.02 24.49,24.64 24.74,24.64 25.02,24.35 25.25,24.35 25.35,24.44 25.35,24.56 25.46,24.67 v1(25.78,24.67)
A4: length 24
  Top Layer w0.1: U1.J3 v1(26.43,24.67) ; v1(15.03,25.86) 14.47,25.86 14.14,26.19 12.19,26.19 U2.G1
  SIG w0.1: v1(26.43,24.67) 26.1,25 19.39,25 18.59,25.81 17.64,25.81 17.25,26.2 17.03,26.2 16.64,25.81 16.41,25.81 16.3,25.92 16.3,26.38 16.14,26.53 16.14,27.02 16.61,27.49 16.61,28.08 16.47,28.21 15.25,28.21 15.03,27.99 15.03,27.67 15.17,27.54 15.67,27.54 15.83,27.38 15.83,27.19 15.68,27.05 15.06,27.05 14.92,26.91 14.92,26.63 15.09,26.45 15.69,26.45 15.83,26.31 15.83,26.05 15.64,25.86 v1(15.03,25.86)
A5: length 24
  Top Layer w0.1: v1(14.11,25.06) 13.77,25.4 13,25.4 U2.G2 ; U1.K3 v1(26.43,24.03)
  SIG w0.1: v1(26.43,24.03) 26.1,23.7 24.54,23.7 23.87,23.03 23.87,22.25 23.73,22.11 23.43,22.11 23.28,22.25 23.28,23.31 23.16,23.42 22.92,23.42 22.78,23.29 22.78,22.22 22.69,22.12 22.38,22.12 22.28,22.22 22.28,23.33 22.17,23.44 21.91,23.44 21.78,23.31 21.78,22.22 21.69,22.12 21.38,22.12 20.94,22.56 20.94,23.33 20.82,23.44 20.57,23.44 20.44,23.31 20.44,22.61 20.28,22.45 20.03,22.45 19.15,23.34 17.94,23.34 17.5,23.78 17.03,23.78 16.38,24.43 16.11,24.43 15.79,24.11 15.06,24.11 14.78,24.39 14.78,24.86 14.58,25.06 v1(14.11,25.06)
A6: length 24
  Top Layer w0.1: U1.P6 29.03,20.78 29.03,19.15 28.67,18.8 v1(28.01,18.8) ; U2.G3 14.03,25.8 14.42,25.4 15.02,25.4 15.44,24.98 15.44,24.44 15.23,24.24 15.23,23.47 15.47,23.23 v1(15.47,21.83)
  SIG w0.1: v1(15.47,21.83) 16.01,21.83 16.83,21 17.98,21 18.48,20.5 18.75,20.5 19.08,20.83 19.37,20.83 19.56,20.64 19.56,20.05 19.84,19.76 20.69,19.76 20.81,19.64 20.81,19.01 21.33,18.49 24.67,18.49 24.98,18.8 v1(28.01,18.8)
A7: length 24
  Top Layer w0.1: U1.N6 v1(29.03,22.08) ; v1(12.2,24.6) U2.H1
  SIG w0.1: v1(12.2,24.6) 12.61,24.6 12.8,24.79 12.8,25.89 12.96,26.05 13.19,26.05 13.36,25.89 13.36,25 14.54,23.81 15.58,23.81 16.78,22.61 18.97,22.61 21.19,20.41 24.13,20.41 24.72,20.98 24.72,22.27 24.97,22.53 26.65,22.53 27.38,21.8 28.19,21.8 28.47,22.08 v1(29.03,22.08)
A8: length 24
  Top Layer w0.1: U1.R7 v1(29.35,19.54) ; v1(15.8,20.61) 14.64,21.78 14.64,24.33 14.38,24.6 13,24.6 U2.H2
  SIG w0.1: v1(15.8,20.61) 15.8,19.49 16.7,18.58 17.16,18.58 17.42,18.85 17.84,18.85 18.75,17.94 20.75,17.94 20.94,17.75 25.55,17.75 25.84,18.03 28.2,18.03 29.35,19.18 v1(29.35,19.54)
A9: length 24
  Top Layer w0.1: v1(14.25,22.36) 14.25,24 14.06,24.2 U2.J3 ; U1.P7 29.68,20.78 29.68,19.03
  SIG w0.1: v1(14.25,22.36) 15.27,21.35 15.27,19.53 17.41,17.39 26.18,17.39 26.5,17.7 28.37,17.7 v1(29.68,19.01)
A10: length 24
  Top Layer w0.1: v1(15.89,21.43) 15.89,23.36 15.67,23.59 15.67,24.05 15.89,24.28 15.89,25.09 U2.G7 ; U1.N7 v1(29.03,21.42)
  SIG w0.1: v1(15.89,21.43) 15.89,21.11 16.81,20.19 18.86,20.19 19.08,19.97 19.08,18.7 19.27,18.52 19.67,18.52 19.84,18.69 19.84,18.95 19.97,19.08 20.19,19.08 21.15,18.13 25.1,18.13 25.41,18.44 28.19,18.44 29.03,19.27 v1(29.03,21.42)
A11: length 24
  Top Layer w0.1: v1(20.68,21.72) 20.68,21.74 21.19,22.25 21.85,22.25 22.28,22.68 22.28,23.7 22.5,23.92 22.84,23.92 23.04,24.12 23.04,24.39 22.86,24.58 22.38,24.58 22,24.19 21.46,24.19 21.26,24.39 21.26,25.03 20.76,25.53 20.09,25.53 19.56,25 U2.H9 ; U1.M7 v1(29.03,22.72)
  SIG w0.1: v1(29.03,22.72) 28.69,22.39 27.32,22.39 26.77,22.94 24.81,22.94 24.44,22.56 24.44,21.15 24.24,20.94 24.01,20.94 23.9,21.06 23.9,21.33 23.77,21.45 23.53,21.45 23.39,21.31 23.39,20.89 23.24,20.75 23.01,20.75 22.88,20.88 22.88,21.35 22.75,21.48 22.51,21.48 22.38,21.34 22.38,20.83 22.28,20.73 21.31,20.73 20.68,21.37 v1(20.68,21.72)
AUDIO: length 30.4
  Top Layer w0.1: U1.P4 27.08,20.78 27.08,19.91 26.47,19.3 26.47,16.13 v1(28.99,13.61) ; R25.1 41.29,23.4 41.01,23.12 v1(41.01,21.87)
  SIG w0.1: v1(41.01,21.87) 41.51,21.37 41.51,19.22 34.31,12.02 30.58,12.02 v1(28.99,13.61)
BA0: length 24
  Top Layer w0.1: v1(16.2,23.8) U2.J7 ; U1.K14 v1(33.57,24.03)
  SIG w0.1: v1(33.57,24.03) 33.25,23.7 32.59,23.7 32.38,23.91 32.16,23.91 31.19,22.94 30.96,22.94 30.84,23.06 30.84,23.44 30.68,23.59 30.44,23.59 30.3,23.44 30.3,23.11 30.08,22.89 29.62,22.89 29.41,23.1 29.41,23.34 29.27,23.48 28.91,23.48 28.66,23.24 28.37,23.24 28.13,23.47 27.87,23.47 27.53,23.12 27.31,23.12 26.91,23.53 26.5,23.53 26.28,23.31 24.67,23.31 24.15,22.8 24.15,22.06 23.9,21.81 22.31,21.81 22.03,21.53 22.03,21.19 21.87,21.03 21.46,21.03 21.14,21.34 21.14,21.86 20.87,22.13 19.91,22.13 19.06,22.98 17.67,22.98 17.19,23.45 16.55,23.45 v1(16.2,23.8)
BA1: length 24
  Top Layer w0.1: v1(17,24.6) U2.H8 ; U1.K13 v1(32.93,24.03)
  SIG w0.1: v1(32.93,24.03) 31.95,25 28.35,25 28.16,25.19 28.16,25.42 28.46,25.7 28.46,25.91 28.09,26.28 28.09,26.44 28.26,26.61 28.9,26.61 29.07,26.8 29.07,27.15 28.94,27.28 28.44,27.28 27.66,26.51 27.66,25.27 26.75,24.35 26.13,24.35 25.81,24.03 24.38,24.03 24.06,23.7 20.09,23.7 19.63,24.17 17.44,24.17 v1(17,24.6)
CKE: length 24
  Top Layer w0.1: U1.M5 v1(28.38,22.72) ; v1(13.8,23.8) 13,23.8 U2.J2
  Bottom Layer w0.1: v1(28.38,22.72) 27.71,23.39 24.18,23.39 21.82,21.03 21.37,21.03 21.16,21.25 21.16,22.29 20.93,22.52 20.93,23.32 21.47,23.87 21.47,24.5 20.57,25.41 18.75,25.41 18.14,26.02 16.82,26.02 16.58,25.78 16.58,25.17 16.39,24.97 15.2,24.97 15,24.78 15,24 14.81,23.8 v1(13.8,23.8)
CLK: length 26.9
  Top Layer w0.1: U1.H14 v1(34.22,24.67) ; v1(12.2,23.8) U2.J1
  SIG w0.1: v1(34.22,24.67) 34.22,23.94 33.34,23.05 31.95,23.05 31.45,22.55 30.09,22.55 29.28,21.75 28.7,21.75 27.04,20.09 21.04,20.09 19.32,21.81 16.61,21.81 15.92,22.5 14.91,22.5 14,23.42 13.28,23.42 12.89,23.8 v1(12.2,23.8)
D+: length 30.1
  Top Layer w0.1: USB_UART.8 58.75,8.71 58.53,8.92 57.96,8.92 v1(57.75,8.72) USB_UART.6 ; U4.1 50.51,25.98 v1(50.68,25.81)
  SIG w0.1: v1(57.75,8.72) 57.96,8.92 57.96,9.17 57.75,9.38 57.75,9.74 57.96,9.95 57.96,10.25 57.38,10.83 55.88,10.83 55.38,11.33 55.38,25.47 54.76,26.08 52.68,26.08 52.58,25.98 52.38,25.98 52.28,26.08 52.1,26.08 52,25.98 51.81,25.98 51.71,26.08 51.52,26.08 51.42,25.98 51.25,25.98 51.16,26.08 50.95,26.08 v1(50.68,25.81)
D-: length 30.5
  Top Layer w0.1: U4.2 50.51,26.48 v1(50.68,26.65) ; v1(58.25,8.47) USB_UART.7 58.25,6.42 58.11,6.28 57.4,6.28 57.25,6.43 USB_UART.5
  SIG w0.1: v1(50.68,26.65) 50.95,26.38 54.88,26.38 55.68,25.59 55.68,11.45 56,11.12 57.5,11.12 58.25,10.38 v1(58.25,8.47)
DQ0: length 24.3
  Top Layer w0.1: v1(18.16,17.86) 18.16,18.64 U2.R8 ; v1(33.57,22.72) U1.M14
  Bottom Layer w0.1: v1(18.16,17.86) 20.97,15.05 29.66,15.05 33.25,18.63 33.25,22.4 v1(33.57,22.72)
DQ1: length 28.9
  Top Layer w0.1: v1(34.22,22.72) U1.L14 ; U2.M8 v1(17.8,21.4)
  Bottom Layer w0.1: v1(34.22,22.72) 34.22,18.41 30.57,14.76 20.51,14.76 17.56,17.7 17.56,18.22 17.81,18.47 17.81,19.78 17.39,20.19 17.39,21 v1(17.8,21.4)
DQ2: length 41.8
  Top Layer w0.1: v1(32.93,29.22) U1.B12 ; U2.M7 v1(17,21.4)
  Bottom Layer w0.1: v1(17,21.4) 16.6,21 15.59,21 14.78,20.19 14.78,18.55 15.37,17.95 16.19,17.95 19.97,14.17 30.86,14.17 35.09,18.39 35.09,28.36 34.22,29.22 v1(32.93,29.22)
DQ3: length 38.9
  Top Layer w0.1: U1.C12 v1(32.93,28.58) ; v1(17,20.6) U2.N7
  Bottom Layer w0.1: v1(17,20.6) 16.6,20.2 15.69,20.2 15.1,19.61 15.1,18.72 15.53,18.29 16.39,18.29 20.22,14.46 30.72,14.46 34.75,18.5 34.75,28 34.5,28.25 33.25,28.25 v1(32.93,28.58)
DQ4: length 21.9
  Top Layer w0.1: v1(29.43,18.03) 30,18.61 U1.R8 ; U2.L8 v1(17.8,22.2)
  Bottom Layer w0.1: v1(29.43,18.03) 29.08,18.03 28.91,18.2 28.91,18.5 28.76,18.64 28.46,18.64 28.22,18.41 28.22,16.52 27.94,16.24 22.98,16.24 22.61,16.61 22.61,18.67 22.2,19.08 21.58,19.08 21.25,18.75 20.25,18.75 18.19,20.8 18.19,21.81 v1(17.8,22.2)
DQ5: length 21.4
  Top Layer w0.1: v1(18.6,19) U2.R9 ; U1.P8 30.32,20.78 30.32,18.17 v1(30,17.84)
  Bottom Layer w0.1: v1(30,17.84) 30,16.67 28.94,15.62 21.32,15.62 21.13,15.81 21.13,16.6 21.88,17.34 21.88,17.67 21.71,17.84 21.32,17.84 21.04,17.56 21.04,17.25 20.88,17.09 20.51,17.09 v1(18.6,19)
DQ6: length 21.9
  Top Layer w0.1: U1.P9 30.97,20.78 30.97,18.09 30.24,17.36 v1(29.53,17.36) ; v1(18.6,19.8) U2.P9
  Bottom Layer w0.1: v1(29.53,17.36) 29.18,17 29.18,16.41 28.69,15.92 21.75,15.92 21.53,16.14 21.53,16.48 22.25,17.2 22.25,18.43 22.06,18.62 21.6,18.62 20.88,17.89 20.5,17.89 v1(18.6,19.8)
DQ7: length 21.5
  Top Layer w0.1: v1(30.65,18.47) U1.R9 ; U2.N8 v1(17.8,20.6)
  Bottom Layer w0.1: v1(17.8,20.6) 18.19,20.2 18.19,18.61 20.16,16.64 20.59,16.64 20.78,16.45 20.78,15.68 21.14,15.33 29.26,15.33 30.65,16.72 30.65,17.03 30.41,17.28 30.41,17.52 30.65,17.76 v1(30.65,18.47)
DQ8: length 25.6
  Top Layer w0.1: v1(31.24,17.75) 31.62,18.14 31.62,20.78 U1.P10 ; v1(13.81,21.39) 13.41,21.8
  SIG w0.1: v1(13.81,21.39) 14.2,21.39 14.55,21.05 14.55,19.39 18.02,15.92 29.4,15.92 31.23,17.75
DQ9: length 25.3
  Top Layer w0.1: U1.R10 v1(31.3,18.42) ; v1(13,22.2) U2.L2
  SIG w0.1: v1(31.3,18.42) 29.12,16.24 18.13,16.24 14.89,19.47 14.89,21.2 14.33,21.77 14.08,21.77 13.65,22.2 v1(13,22.2)
DQ10: length 26.9
  Top Layer w0.1: U1.N11 v1(31.62,21.42) ; v1(13.8,20.6) U2.N3
  SIG w0.1: v1(31.62,21.42) 31.62,17 29.94,15.33 17.72,15.33 13.8,19.24 v1(13.8,20.6)
DQ11: length 32.2
  Top Layer w0.1: U2.P1 11.17,19.57 11.17,18.72 11.83,18.06 v1(12.39,18.06) ; v1(33.21,15.69) 32.58,16.32 32.58,17.66 32.28,17.97 32.28,20.78 U1.P11
  SIG w0.1: v1(12.39,18.06) 16.28,14.17 31.68,14.17 v1(33.21,15.69)
DQ12: length 26.8
  Top Layer w0.1: v1(13,20.6) U2.N2 ; v1(31.95,16.75) U1.R11
  SIG w0.1: v1(31.95,16.75) 30.25,15.05 17.54,15.05 13.47,19.12 13.47,20.14 v1(13,20.6)
DQ13: length 32.1
  Top Layer w0.1: U1.P14 34.22,20.78 34.79,20.78 35.54,20.03 v1(35.54,19.62) ; v1(13.64,17.56) U2.R1
  SIG w0.1: v1(35.54,19.62) 35.21,19.3 33.03,19.3 32.78,19.05 32.78,16.19 31.06,14.46 16.74,14.46 v1(13.64,17.56)
DQ14: length 37
  Top Layer w0.1: v1(31.11,17.1) 31.4,16.81 31.4,15.5 32.94,13.95 34.37,13.95 36.52,16.11 36.52,19.54 34.97,21.1 U1.P15 ; v1(13,21.4) U2.M2
  SIG w0.1: v1(31.11,17.1) 29.63,15.62 17.88,15.62 14.22,19.28 14.22,20.73 13.96,21 13.4,21 v1(13,21.4)
DQ15: length 31.3
  Top Layer w0.1: v1(13.77,18.23) U2.R2 ; U1.N15 35.4,21.75 v1(35.85,21.3)
  SIG w0.1: v1(35.85,21.3) 35.85,20.8 34.94,19.88 33.06,19.88 32.4,19.22 32.4,16.45 30.7,14.76 17.24,14.76 v1(13.77,18.23)
DQ16: length 22.9
  Top Layer w0.1: U1.M12 v1(32.28,22.72) ; v1(17,27.8) U2.E8
  Bottom Layer w0.1: v1(17,27.8) 17.65,28.45 17.88,28.45 18.43,29 20.81,29 21.36,29.55 22.75,29.55 23.47,30.27 26.28,30.27 28.05,28.49 28.05,27.17 28.38,26.83 28.94,26.83 29.35,26.42 29.35,23.55 29.72,23.18 30.08,23.18 30.53,22.72 v1(32.28,22.72)
DQ17: length 26.4
  Top Layer w0.1: U1.M13 v1(32.93,22.72) ; v1(16.2,28.6) U2.D7
  Bottom Layer w0.1: v1(32.93,22.72) 33.39,23.19 33.39,23.57 33.26,23.7 32.75,23.7 32.6,23.84 32.6,25.73 31.54,26.79 31.54,28.98 29.78,30.74 28.03,30.74 26.96,31.81 22.56,31.81 21.86,31.1 20.82,31.1 20.32,30.59 18.19,30.59 v1(16.2,28.6)
DQ18: length 24.2
  Top Layer w0.1: v1(17,28.6) U2.D8 ; U1.L13 v1(32.93,23.38)
  Bottom Layer w0.1: v1(32.93,23.38) 32.6,23.05 30.69,23.05 30,23.75 30,29.05 29.44,29.61 27.45,29.61 26.41,30.66 23.27,30.66 22.58,29.97 21.29,29.97 20.7,29.38 18.37,29.38 17.99,29 17.4,29 v1(17,28.6)
DQ19: length 21.9
  Top Layer w0.1: U1.L12 v1(32.28,23.38) ; v1(18.6,30.2) U2.B9
  Bottom Layer w0.1: v1(18.6,30.2) 20.45,30.2 20.95,30.71 22.06,30.71 22.8,31.44 26.76,31.44 27.84,30.36 29.68,30.36 31.19,28.84 31.19,26.61 31.75,26.06 31.75,25.78 31.4,25.43 31.4,25.16 31.6,24.95 32.12,24.95 32.28,24.79 32.28,24.53 32.03,24.28 32.03,24 32.28,23.75 v1(32.28,23.38)
DQ20: length 22.8
  Top Layer w0.1: v1(31.62,24.03) 32.28,24.03 U1.K12 ; v1(17.8,29.4) U2.C8
  Bottom Layer w0.1: v1(31.62,24.03) 31.12,23.52 30.83,23.52 30.65,23.69 30.65,26.42 30.87,26.64 30.87,28.68 29.57,29.98 27.64,29.98 26.56,31.06 23.03,31.06 22.3,30.32 21.12,30.32 20.6,29.8 18.19,29.8 v1(17.8,29.4)
DQ21: length 22
  Top Layer w0.1: U1.E12 v1(32.28,27.28) ; v1(18.6,31) U2.A9
  Bottom Layer w0.1: v1(32.28,27.28) 31.86,27.69 31.86,29.14 29.91,31.1 28.23,31.1 28.01,31.31 28.01,31.5 28.19,31.67 28.41,31.67 28.54,31.81 28.54,32.05 28.43,32.16 28.16,32.16 27.92,31.93 27.4,31.93 27.13,32.2 22.42,32.2 21.96,31.74 21.7,31.74 21.62,31.83 21.62,32.12 21.5,32.23 21.28,32.23 21.15,32.1 21.15,31.62 20.99,31.46 20.72,31.46 20.44,31.74 20.21,31.74 20.07,31.6 20.07,31.17 19.9,31 19.6,31 19.43,31.17 19.43,31.58 19.26,31.75 19.04,31.75 18.85,31.57 18.85,31.26 v1(18.6,31)
DQ22: length 21.4
  Top Layer w0.1: U1.E13 v1(32.93,26.62) ; v1(18.2,31.4) U2.A8
  Bottom Layer w0.1: v1(18.2,31.4) 18.9,32.1 20.66,32.1 21.16,32.6 27.27,32.6 27.61,32.26 27.83,32.26 28.17,32.6 28.68,32.6 28.85,32.42 28.85,31.5 28.96,31.4 29.22,31.4 29.44,31.62 29.66,31.62 29.88,31.4 30.08,31.4 32.19,29.29 32.19,28 32.93,27.28 v1(32.93,26.62)
DQ23: length 24.4
  Top Layer w0.1: v1(16.2,29.4) U2.C7 ; U1.D13 v1(32.93,27.92)
  Bottom Layer w0.1: v1(32.93,27.92) 32.54,28.31 32.54,29.5 29.04,33 21.03,33 20.51,32.48 16.54,32.48 15.26,31.19 15.26,30.34 v1(16.2,29.4)
DQ24: length 26
  Top Layer w0.1: U1.E14 34.22,27.28 v1(34.22,27.92) ; v1(13.75,31.74) U2.A2
  SIG w0.1: v1(34.22,27.92) 33.9,28.25 33.9,28.89 31.26,31.53 20.32,31.53 19.08,32.77 14.77,32.77 v1(13.75,31.75)
DQ25: length 24.8
  Top Layer w0.1: v1(13.8,29.4) U2.C3 ; U1.D14 v1(33.57,27.92)
  SIG w0.1: v1(33.57,27.92) 33.25,28.25 32.46,28.25 31.69,29.02 31.69,29.94 30.81,30.83 19.99,30.83 18.75,32.06 15.41,32.06 14.5,31.16 14.5,30.11 v1(13.8,29.4)
DQ26: length 26.2
  Top Layer w0.1: U1.C14 v1(34.22,28.58) ; U2.A1 v1(12.74,31.54)
  SIG w0.1: v1(34.22,28.58) 34.22,29.22 31.56,31.88 20.5,31.88 19.22,33.16 14.36,33.16 v1(12.74,31.54)
DQ27: length 25.4
  Top Layer w0.1: U1.C13 v1(33.57,28.58) ; v1(13,29.4) U2.C2
  SIG w0.1: v1(33.57,28.58) 33.25,28.9 32.59,28.9 32.12,29.38 32.12,30.11 31.04,31.18 20.13,31.18 18.91,32.41 15.14,32.41 14.03,31.3 14.03,30.43 v1(13,29.4)
DQ28: length 23.1
  Top Layer w0.1: U2.B1 v1(12.2,29.4) ; U1.C3 v1(27.07,27.92)
  SIG w0.1: v1(27.07,27.92) 27.68,27.92 27.89,28.14 27.89,28.73 28.5,29.34 28.5,30.06 28.07,30.48 19.84,30.48 18.57,31.75 15.67,31.75 14.97,31.06 14.97,29.9 14.07,29 12.6,29 v1(12.2,29.4)
DQ29: length 22.5
  Top Layer w0.1: v1(12.2,28.6) U2.D2 ; U1.C2 v1(25.78,28.58)
  SIG w0.1: v1(12.2,28.6) 11.91,28.3 11.91,27.84 12.17,27.58 12.78,27.58 13.26,28.06 14.22,28.06 15.98,29.82 27.59,29.82 27.73,29.69 27.73,29.44 27.53,29.24 27.23,29.24 27.06,29.08 27.06,28.8 26.91,28.64 26.58,28.64 26.42,28.8 26.42,29.09 26.27,29.24 25.99,29.24 25.78,29.03 v1(25.78,28.58)
DQ30: length 22.4
  Top Layer w0.1: v1(13.8,28.6) U2.D3 ; U1.D3 v1(26.43,27.92)
  SIG w0.1: v1(13.8,28.6) 14.3,28.6 15.36,29.67 15.36,30.94 15.83,31.4 16.08,31.4 16.23,31.26 16.23,30.85 16.47,30.6 16.72,30.6 16.97,30.85 16.97,31.28 17.12,31.42 17.58,31.42 17.75,31.25 17.75,30.78 17.94,30.6 19,30.6 19.45,30.14 27.99,30.14 28.19,29.94 28.19,29.45 27.53,28.8 27.53,28.48 27.34,28.3 26.79,28.3 v1(26.43,27.92)
DQ31: length 21.4
  Top Layer w0.1: U1.E3 v1(26.43,27.28) ; v1(13,27) U2.E2
  SIG w0.1: v1(26.43,27.28) 25.45,28.25 25.45,29.31 25.26,29.5 24.96,29.5 24.96,29.49 24.69,29.22 24.43,29.22 24.16,29.5 21.46,29.5 21.19,29.22 20.84,29.22 20.56,29.5 20.22,29.5 19.73,29 19.41,29 18.91,29.5 18.53,29.5 18.03,29 17.51,29 17.12,29.39 16.75,29.39 16.37,29 15.58,29 14.6,28.02 14.6,26.89 14.47,26.75 14.22,26.75 14.08,26.88 14.08,27.58 13.97,27.7 13.7,27.7 13.57,27.57 13.57,26.56 13.45,26.44 13.12,26.44 13,26.56 v1(13,27)
F_CS: length 22.2
  Top Layer w0.1: U5.1 14.05,12.38 14.26,12.59 14.26,14.91 15.08,15.73 19.07,15.73 20.23,16.89 20.23,18.56 23.15,21.48 23.15,22.94 24.24,24.03 25.78,24.03 U1.K2
F_HOLD: length 6.9
  Top Layer w0.1: 18.09,11.11 17.61,11.11 17.44,10.92 17.44,5.87 17.22,5.66 R12.2
F_MISO: length 28.7
  Top Layer w0.1: v1(14.89,9.02) 14.55,9.37 14.55,10.8 14.23,11.11 U5.2 ; v1(20.91,9.02) 21.25,9.36 21.25,18.42 23.94,21.11 23.94,22.64 24.66,23.36 26.44,23.36 U1.L3
  SIG w0.1: v1(20.91,9.02) v1(14.89,9.02)
F_MOSI: length 19
  Top Layer w0.1: U1.L2 25.77,22.72 25.04,22.72 24.6,22.28 24.6,20.53 22.21,18.14 22.21,13.02 21.86,12.66 21.86,9.2 21.22,8.56 U5.5
F_SCLK: length 17.9
  Top Layer w0.1: U5.6 20.5,9.83 20.75,10.09 20.75,18.52 23.54,21.31 23.54,22.8 24.44,23.7 U1.K1
F_WP: length 3.3
  Top Layer w0.1: R11.2 12.29,9.83
I2C_SCL: length 39.4
  Top Layer w0.1: v1(29.01,34.16) 29.01,29.21 U1.B6 ; R13.1 7.68,39.72 6.56,39.72 H1.2
  Bottom Layer w0.1: H1.2 10.92,42.09 12.69,40.32 19.41,40.32 20.2,39.54 23.63,39.54 v1(29.01,34.16)
I2C_SDA: length 41.9
  Top Layer w0.1: H1.1 2.94,40.8 4.75,40.8 R14.1 ; v1(28.05,34.33) 28.05,32.52 28.38,32.19 28.38,29.22 U1.B5
  Bottom Layer w0.1: H1.1 2.94,40.8 11.3,40.8 12.3,39.81 18.96,39.81 20.42,38.34 24.04,38.34 v1(28.05,34.33)
KEY1: length 34.3
  Top Layer w0.1: v1(27.72,24.67) U1.H4 ; R28.1 8.05,12.05 8.49,12.49 9.75,12.49 10.46,13.19 13.36,13.19 13.58,13.41 13.58,14.85 15.12,16.39 18.91,16.39 19.76,17.25 19.76,18.76 21.62,20.62 v1(21.62,21.44)
  Bottom Layer w0.1: v1(21.62,21.44) 23.87,23.7 27.25,23.7 27.4,23.86 27.4,24.35 v1(27.72,24.67)
KEY2: length 17.8
  Top Layer w0.1: R29.1 26.32,6.8 25.69,7.44 25.69,11.11 24.96,11.83 v1(24.96,16.8) ; U1.N3 v1(26.43,21.42)
  Bottom Layer w0.1: v1(26.43,21.42) 26.43,18.99 24.96,17.53 v1(24.96,16.8)
KEY3: length 28.8
  Top Layer w0.1: v1(38.38,22.58) 37.91,23.05 U1.L15 ; v1(44.48,7.11) 42.43,7.11 42.13,6.81 R30.1
  SIG w0.1: v1(38.38,22.58) 41.38,22.58 46.22,17.75 46.22,8.85 v1(44.48,7.11)
LCD_B0: length 27.6
  Top Layer w0.1: v1(25.6,47.03) 26.15,47.58 30.71,47.58 31.25,47.04 LCD.21 ; U1.B1 23.71,30.64 v1(23.71,40.71)
  Bottom Layer w0.1: v1(23.71,40.71) 24.25,41.25 24.25,44.98 25.6,46.33 v1(25.6,47.03)
LCD_B1: length 18.3
  Top Layer w0.1: LCD.22 31.75,41.16 32.95,39.96 32.95,37.97 29.67,34.69 29.67,29.23 U1.B8
LCD_B2: length 23.9
  Top Layer w0.1: U1.B11 32.28,29.23 32.28,31.41 34.38,33.51 37.18,33.51 38,34.33 38,35.99 36.25,37.75 36.25,40.97 35.16,42.06 33.32,42.06 32.25,43.13 LCD.23
LCD_B3: length 18.6
  Top Layer w0.1: U1.B9 30.32,29.22 30.32,33.4 33.66,36.73 33.66,40.3 v1(32.28,41.68) ; LCD.24 v1(32.75,43.8)
  Bottom Layer w0.1: v1(32.28,41.68) 32.28,42.52 32.75,43 v1(32.75,43.8)
LCD_B4: length 38
  Top Layer w0.1: U1.D4 v1(27.07,27.28) ; v1(23.25,41.22) 23.25,38 22.73,37.47 v1(22.73,29) ; v1(24.2,48.11) 24.59,48.5 32.62,48.5 33.25,47.86 LCD.25
  Bottom Layer w0.1: v1(22.73,29) 22.73,27.94 23.06,27.6 26.75,27.6 v1(27.07,27.28) ; v1(24.2,48.11) 24.2,46.33 23.25,45.38 v1(23.25,41.22)
LCD_B5: length 23.9
  Top Layer w0.1: v1(28.02,42.26) 25.41,39.65 25.41,31.64 26.43,30.62 26.43,28.74 26.59,28.58 27.07,28.58 U1.C4 ; LCD.26 v1(33.75,43.8)
  SIG w0.1: v1(33.75,43.8) 32.74,42.78 28.54,42.78 v1(28.02,42.26)
LCD_B6: length 20.9
  Top Layer w0.1: LCD.27 34.25,43.42 v1(33.59,42.77) ; v1(28.39,39.54) 28.39,36.42 27.54,35.57 27.54,32.36 28.05,31.85 U1.A5
  SIG w0.1: v1(28.39,39.54) 28.39,41.48 29.19,42.29 33.12,42.29 v1(33.59,42.77)
LCD_B7: length 23.2
  Top Layer w0.1: v1(31.56,40.25) 28.06,40.25 27.07,39.27 27.07,32.22 27.72,31.57 27.72,29.22 U1.B4 ; LCD.28 v1(34.75,43.18)
  Bottom Layer w0.1: v1(31.56,40.25) 33.69,40.25 34.25,40.81 34.25,42.68 v1(34.75,43.18)
LCD_BLK: length 27.3
  Top Layer w0.1: U7.4 v1(16.15,48.65) ; U1.A6 28.7,32.56 28.56,32.7 v1(28.56,35.55)
  Bottom Layer w0.1: v1(16.15,48.65) 16.69,48.12 16.69,46.25 18.01,44.92 18.01,42.8 20.75,40.06 24.03,40.06 v1(28.56,35.55)
LCD_CLK: length 28.7
  Top Layer w0.1: LCD.30 35.75,42.83 ; 35.75,42.83 37.01,41.57 37.77,41.57 40.71,38.63 40.71,27.3 37.44,24.03 34.22,24.03 U1.J14
LCD_DE: length 63.7
  Top Layer w0.1: U1.L1 24.85,23.05 24.26,22.46 24.26,20.8 21.74,18.27 v1(21.74,13.69) ; LCD.34 37.75,43.83 38.61,42.97 39.5,42.97 40.31,42.16 40.31,41.22 42.01,39.52 42.01,26.36 39.98,24.32 39.98,17.47 34.01,11.5 29.31,11.5 v1(27.12,13.69)
  Bottom Layer w0.1: v1(27.12,13.69) v1(21.74,13.69)
LCD_EN: length 21.2
  Top Layer w0.1: LCD.31 36.25,43.17 37.12,42.31 37.92,42.31 v1(38.4,41.83) ; U1.A11 31.95,31.61 34.4,34.06 37.02,34.06 37.2,34.23 v1(37.2,35.64)
  Bottom Layer w0.1: v1(38.4,41.83) 38.4,36.83 v1(37.2,35.64)
LCD_G0: length 18
  Top Layer w0.1: U1.B2 25.78,29.22 25.78,30.17 24.61,31.34 24.61,40.02 27.25,42.66 LCD.13
LCD_G1: length 18.2
  Top Layer w0.1: U1.B3 27.07,29.22 27.07,31.1 26.24,31.94 26.24,39.41 28.75,41.92 28.75,42.85 27.75,43.84 LCD.14
LCD_G2: length 72.5
  Top Layer w0.1: U1.P3 26.43,20.78 26.43,20.01 25.79,19.38 25.79,13.41 26.53,12.67 27.53,12.67 29.12,11.08 34.28,11.08 40.49,17.3 40.49,24.02 42.47,26 42.47,39.83 40.84,41.47 40.84,42.39 v1(39.58,43.64) ; LCD.15 v1(28.25,46.54)
  SIG w0.1: v1(39.58,43.64) 39.58,47.47 38.56,48.5 30.21,48.5 v1(28.25,46.54)
LCD_G3: length 22.3
  Top Layer w0.1: LCD.16 v1(28.75,43.8) ; U1.B10 30.97,29.22 30.97,32.61 33.03,34.66 33.69,34.66 35,35.97 35,39.7 v1(33.64,41.06)
  Bottom Layer w0.1: v1(28.75,43.8) 31.49,41.06 v1(33.64,41.06)
LCD_G4: length 48.1
  Top Layer w0.1: v1(33.73,16.33) 33.21,16.33 32.96,16.58 32.96,17.9 32.6,18.26 U1.R12 ; LCD.17 v1(29.25,46.54)
  SIG w0.1: v1(35.46,40.75) 35.46,42.89 36.21,43.64 36.21,46.84 35.47,47.58 30.28,47.58 v1(29.25,46.54)
  Bottom Layer w0.1: v1(33.73,16.33) 34.22,16.82 34.94,16.82 36.74,18.61 36.74,25.57 35.94,26.37 35.94,27.66 37.33,29.05 37.33,34.58 36.62,35.3 36.62,38.69 35.46,39.84 v1(35.46,40.75)
LCD_G5: length 42
  Top Layer w0.1: LCD.18 v1(29.75,43.8) ; U1.R13 33.25,18.81 33.75,18.31 33.75,17.72 34.13,17.33 v1(34.72,17.33)
  Bottom Layer w0.1: v1(34.72,17.33) 36.32,18.92 36.32,25.36 35.6,26.08 35.6,27.83 36.94,29.17 36.94,34.36 36.11,35.19 36.11,38.49 34.81,39.78 34.81,42.25 35.82,43.25 35.82,44.08 35.43,44.47 32.38,44.47 31.1,43.19 30.36,43.19 v1(29.75,43.8)
LCD_G6: length 34
  Top Layer w0.1: U1.G15 37.12,25.65 39.33,27.86 39.33,36.94 v1(37.71,38.57) ; LCD.19 v1(30.25,46.54)
  Bottom Layer w0.1: v1(37.71,38.57) 37.71,39.2 36.24,40.67 36.24,46.81 35.47,47.58 31.28,47.58 v1(30.25,46.54)
LCD_G7: length 28.6
  Top Layer w0.1: LCD.20 v1(30.75,43.8) ; U1.D11 31.95,26.95 v1(32.28,26.62)
  SIG w0.1: v1(34.25,39.44) 34.25,44.2 33.9,44.55 32.69,44.55 31.55,43.41 31.14,43.41 v1(30.75,43.8) ; v1(32.28,26.62) 32.6,26.3 33.28,26.3 34.06,27.08 34.89,27.08 35.72,27.92 v1(35.72,28.59)
  Bottom Layer w0.1: v1(35.72,28.59) 36.56,29.43 36.56,34.09 35.58,35.06 35.58,38.11 v1(34.25,39.44)
LCD_HS: length 25.4
  Top Layer w0.1: v1(37.71,40.02) 39.77,37.95 39.77,27.7 36.83,24.77 34.78,24.77 U1.H15 ; 36.75,45.29 v1(36.75,43.8)
  Bottom Layer w0.1: v1(36.75,43.8) 36.75,40.97 v1(37.71,40.02)
LCD_LEDA: length 15.2
  Top Layer w0.35: D1.2 C30.2 16.36,40.17 17.57,38.95 20.43,38.95 21.75,40.28 21.75,45.29
LCD_LEDK: length 15.1
  Top Layer w0.35: U7.3 15.03,45.5 15.33,45.2 17.06,45.2 17.88,44.39 17.88,40.99 18.31,40.56 R15.1 20.81,40.56 21.25,41 21.25,44.85
LCD_R0: length 24.1
  Top Layer w0.1: LCD.5 23.25,42.14 22.59,41.48 22.59,38.35 22.2,37.96 v1(22.2,29) ; U1.F4 v1(27.07,25.97)
  Bottom Layer w0.1: v1(22.2,29) 22.2,27.88 24.43,25.65 26.75,25.65 v1(27.07,25.97)
LCD_R1: length 25.4
  Top Layer w0.1: U1.G4 v1(27.07,25.33) ; v1(21.66,29) v1(21.66,38.85) ; LCD.6 v1(23.75,43.8)
  SIG w0.1: v1(21.66,38.85) 22.2,39.39 22.2,41.09 23.75,42.64 v1(23.75,43.8)
  Bottom Layer w0.1: v1(21.66,29) 21.66,27.81 24.47,25 26.75,25 v1(27.07,25.33)
LCD_R2: length 23.3
  Top Layer w0.1: LCD.7 24.25,42.77 24.79,42.22 v1(25.42,42.22) ; v1(35.1,31.03) 34.22,30.15 34.22,29.22 U1.B14
  Bottom Layer w0.1: v1(25.42,42.22) 26.29,41.36 26.29,39.37 31.04,34.62 31.04,32.73 31.93,31.84 34.84,31.84 35.1,31.58 v1(35.1,31.03)
LCD_R3: length 66.5
  Top Layer w0.1: v1(39.13,41.75) 39.13,41 41.12,39.01 41.12,27 39.03,24.9 39.03,17.86 34.18,13.02 32.71,13.02 27.36,18.36 27.36,19.06 28.05,19.75 U1.R5 ; LCD.8 v1(24.75,46.54)
  Bottom Layer w0.1: v1(39.13,41.75) 38.12,42.77 38.12,47.11 36.73,48.5 25.47,48.5 24.75,47.78 v1(24.75,46.55)
LCD_R4: length 23.1
  Top Layer w0.1: v1(25,43.06) 25.25,43.32 LCD.9 ; v1(35.54,29.24) U1.C15
  Bottom Layer w0.1: v1(35.54,29.24) 34.24,30.55 33.56,30.55 32.72,31.39 31.65,31.39 30.44,32.6 30.44,34.46 24.73,40.17 24.73,42.8 v1(25,43.06)
